# Altium schematic sheet 1602版.SchDoc
size A4
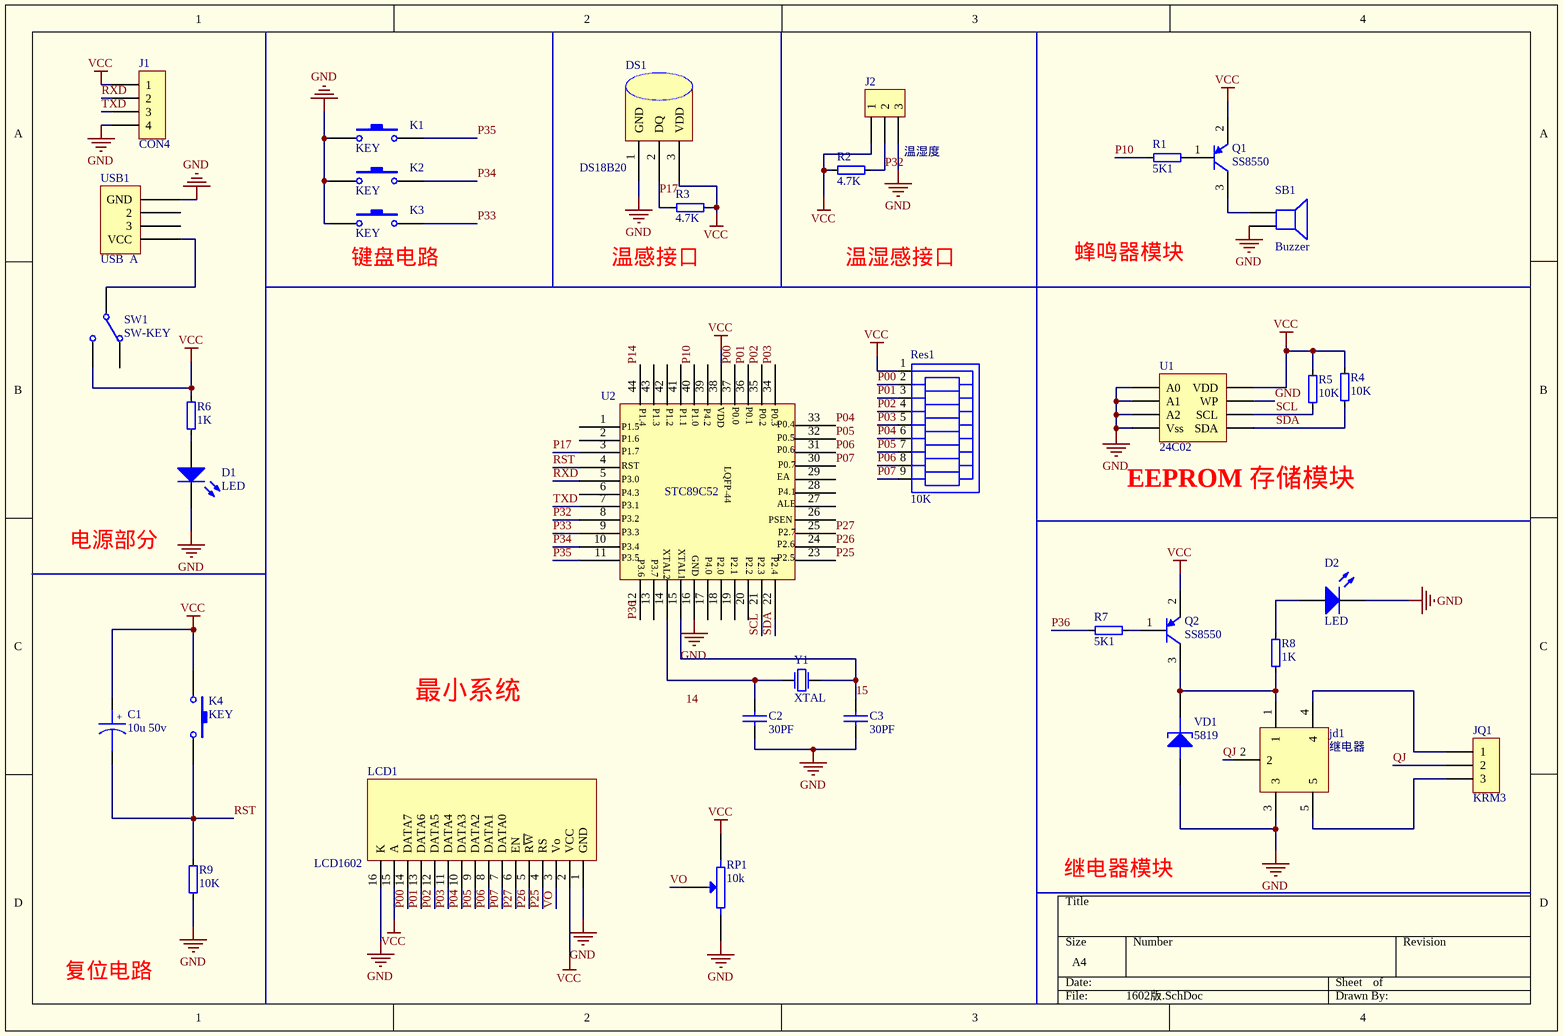
[diagram p0: 1602版.SchDoc]

## Parts
C1  10u 50v  [10uf 50v]
C2  30PF  [C0805]
C3  30PF  [C0805]
D1  LED  [LED]
D2  LED  [LED]
DS1  DS18B20  [DS18B20]
J1  CON4  [CON4]
J2  温湿度  [×3]
jd1  继电器  [继电器2]
JQ1  KRM3  [KRM3]
K1  KEY  [KEY]
K2  KEY  [KEY]
K3  KEY  [KEY]
K4  KEY  [KEY]
LCD1  LCD1602  [LCD1602]
Q1  SS8550  [SOT-23]
Q2  SS8550  [SOT-23]
R1  5K1  [R0805]
R2  4.7K  [R0805]
R3  4.7K  [R0805]
R4  10K  [R0805]
R5  10K  [R0805]
R6  1K  [R0805]
R7  5K1  [R0805]
R8  1K  [R0805]
R9  10K  [R0805]
Res1  10K  [Res-8]
RP1  10k  [RE3296]
SB1  Buzzer  [BUZZER]
SW1  SW-KEY  [SW-KEY]
U1  24C02  [24c02]
U2  STC89C52  [TQFP-44]
USB1  USB  A  [USB A]
VD1  5819  [SS24二极管]
Y1  XTAL  [XTAL]

## Nets
GND: C2.2 C3.2 D1.2 D2.2 DS1.1(GND) J1.4 J2.3 jd1.3 K1.1 K2.1 K3.1 LCD1.1(GND) LCD1.16(K) R9.1 RP1.1 SB1.2 U1.1(A0) U1.2(A1) U1.3(A2) U1.4(Vss) U1.7(WP) U2.16(VSS) USB1.1(GND) VD1.1(A)
VCC: C1.1 DS1.3(VDD) J1.1 J2.1 K4.1 LCD1.2(VCC) LCD1.15(A) Q1.2(E) Q2.2(E) R2.2 R3.1 R4.2 R5.2 R6.1 Res1.1 RP1.2 SW1.2(NO1) U1.8(VDD) U2.38(VDD)
15: C3.1 U2.15(XTAL1) Y1.2(P2)
P00: LCD1.14(DATA7) Res1.2 U2.37(P0.0)
P01: LCD1.13(DATA6) Res1.3 U2.36(P0.1)
P02: LCD1.12(DATA5) Res1.4 U2.35(P0.2)
P03: LCD1.11(DATA4) Res1.5 U2.34(P0.3)
P04: LCD1.10(DATA3) Res1.6 U2.33(P0.4)
P05: LCD1.9(DATA2) Res1.7 U2.32(P0.5)
P06: LCD1.8(DATA1) Res1.8 U2.31(P0.6)
P07: LCD1.7(DATA0) Res1.9 U2.30(P0.7)
P10: R1.2 U2.40(CLKOUT2/ADC0/P1.0)
P14: U2.44(SS/CCP1/ADC4/P1.4)
P17: DS1.2(DQ) R3.2 U2.3(MOSI/ADC67P1.7)
P25: LCD1.4(RS) U2.23(P2.5/A13)
P26: LCD1.5(R~{W}) U2.24(P2.6/A14)
P27: LCD1.6(EN) U2.25(P2.7/A15)
P32: J2.2 R2.1 U2.8(~{INTO}/P3.2)
P33: K3.2 U2.9(~{INT1}/P3.3)
P34: K2.2 U2.10(CLKOUT0/~{INT}/T0/P3.4)
P35: K1.2 U2.11(CLKOUT1/~{INT}/T1/P3.5)
P36: R7.2 U2.12(P3.6/~{WR})
QJ: jd1.2 JQ1.2
RST: C1.2 K4.2 R9.2 U2.4(RST)
RXD: J1.2 U2.5(~{INT}/RXD/P3.0)
SCL: R5.1 U1.6(SCL) U2.21(P2.3/A11)
SDA: R4.1 U1.5(SDA) U2.22(P2.4/A12)
TXD: J1.3 U2.7(TXD/P3.1)
VO: LCD1.3(Vo) RP1.3
NetC2_1: C2.1 U2.14(XTAL2) Y1.1(P1)
NetD1_1: D1.1 R6.2
NetD2_1: D2.1 R8.1
Netjd1_1: jd1.1 Q2.3(C) R8.2 VD1.2(K)
Netjd1_4: jd1.4 JQ1.1
Netjd1_5: jd1.5 JQ1.3
NetQ1_1: Q1.1(B) R1.1
NetQ1_3: Q1.3(C) SB1.1
NetQ2_1: Q2.1(B) R7.1
NetSW1_1: SW1.1(COMMON1) USB1.4(VCC)

Not connected (* = marked no-connect by the designer): SW1 3(NC1); U2 1(MOSI/ADC5/P1.5) 2(MOSI/ADC6/P1.6) 6(SCLK/TXD2/CCP1/P4.3) 13(P3.7/~{RD}) 17(P4.0/SS) 18(P2.0/A18) 19(P2.1/A9) 20(P2.2/A10) 26(NA/P4.4) 27(ALE/P4.5) 28(P4.1/ECI/MOSI) 29(EX_LVD/P4.6/RST2) 39(MISO/RXD2/CCP0/P4.2) 41(ADC1/P1.1) 42(RXD2/ECI/ADC2/P1.2) 43(TXD2/CCP0/ADC3/P1.3); USB1 2 3

## Notes on the sheet
- (near K3) 键盘电路
- (near R3) 温感接口
- 温湿感接口
- 蜂鸣器模块
- (near U1) EEPROM 存储模块
- 电源部分
- 最小系统
- 继电器模块
- 复位电路
- Labels drawn without touching a wire or pin: 14
- (in symbol 10u 50v) +
- (in symbol STC89C----) P1.4; P1.3; P1.2; P1.1; P1.0; P4.2; P1.5; P1.6; P1.7; LQFP-44; P3.0; EA; P4.3; P4.1; P3.1; ALE; P3.2; PSEN; P3.3; P2.7; P3.4; GND; P2.6; P3.6; P3.7; P4.0; P2.0; P2.1; P2.2; P2.3; P2.4; P3.5; P2.5

## Library data of the parts
C2 C3 = CAP
J2 = ×3
jd1 = 继电器2
Q1 Q2 = SS8550: PNP贴片三极管; Published: 8-Jun-2000; LatestRevisionDate: 15-Jan-2003; LatestRevisionNote: PCB Footprint 'BCY-W3/D4.7' replaced; DatasheetDocument: 1997; PackageDocument: Sep-1998; PackageReference: TO-92A; Publisher: Altium Limited; Code_JEDEC: TO-92A; ComponentLink1Description: Manufacturer Link; ComponentLink1URL: http://www.fairchildsemi.com/; ComponentLink2Description: Datasheet; ComponentLink2URL: http://www.fairchildsemi.com/ds/2N%2F2N3906.pdf
R1-R9 = RESistor
Res1 = Res-8
RP1 = RP1
U2 = STC89C----
VD1 = SS24二极管: Tunnel FDiode